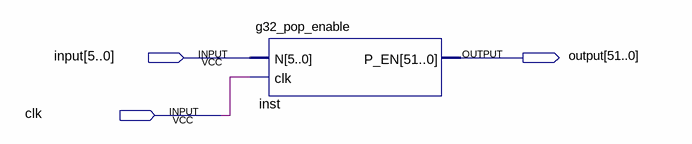
[diagram p0: schematic sheet]
// Quartus schematic test.bdf as structural Verilog: 1 symbols, 3 pins
module test (
  input  [5:0] \input ,
  input  clk,
  output [51:0] \output 
);

  g32_pop_enable inst (.N(\input ), .clk(clk), .P_EN(\output ));
endmodule
